# Altium schematic sheet stm32.SchDoc
size A4; SheetNumber: 7; SheetTotal: 8
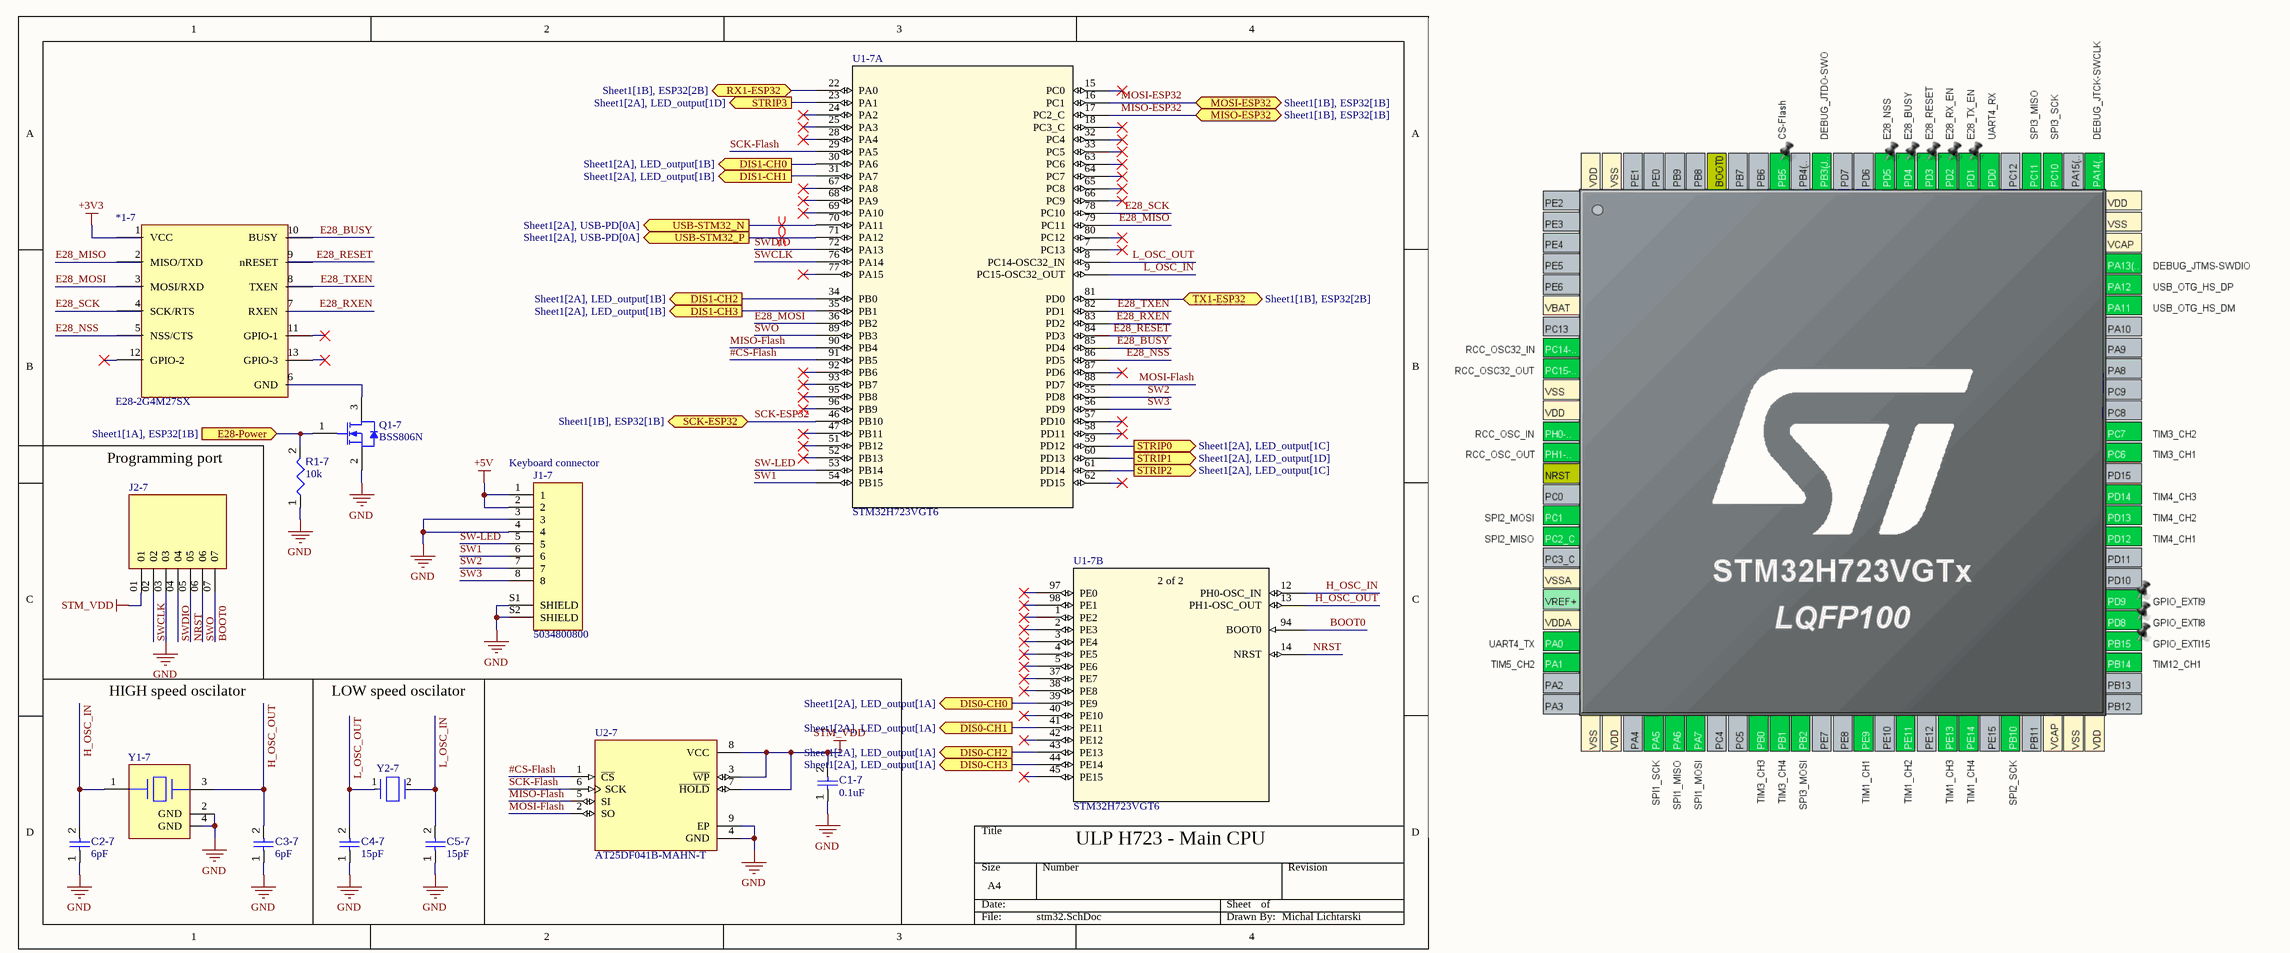
[diagram p0: stm32.SchDoc]

## Parts
*1-7  E28-2G4M27SX  [PCBComponent_1]
C1-7  value 0.1uF  [CAPC1608X94X35NL15T15]  (hidden comment: 0.1uF 0603)
C2-7  value 6pF  [CAPC1608X94X35NL15T15]  (hidden comment: 6pF 0603)
C3-7  value 6pF  [CAPC1608X94X35NL15T15]  (hidden comment: 6pF 0603)
C4-7  value 15pF  [CAPC1608X94X35NL15T15]  (hidden comment: 15pF 0603)
C5-7  value 15pF  [CAPC1608X94X35NL15T15]  (hidden comment: 15pF 0603)
J1-7  5034800800  [MOLEX_5034800800]
J2-7  TSW-107-07-G-S  [SAMTEC_TSW-107-07-G-S]  (value not drawn)
Q1-7  BSS806N  [INF-PG-SOT23_M]
R1-7  10K  [RESC1608X55X25ML10T15]
U1-7  STM32H723VGT6  [Model Name]  (parts A,B of 3)
U2-7  AT25DF041B-MAHN-T  [PSON50P200X300X60-9N]
Y1-7  CX2016DB40000D0FLJCC  [FP-CX2016DB-MFG]  (value not drawn)
Y2-7  ABS07-32.768KHZ-7-T  [FP-ABS07-MFG]  (value not drawn)

## Ports
DIS0-CH0 (out, see Sheet1[2A], LED_output[1A]), DIS0-CH1 (out, see Sheet1[2A], LED_output[1A]), DIS0-CH2 (out, see Sheet1[2A], LED_output[1A]), DIS0-CH3 (out, see Sheet1[2A], LED_output[1A]), DIS1-CH0 (out, see Sheet1[2A], LED_output[1B]), DIS1-CH1 (out, see Sheet1[2A], LED_output[1B]), DIS1-CH2 (out, see Sheet1[2A], LED_output[1B]), DIS1-CH3 (out, see Sheet1[2A], LED_output[1B]), E28-Power (in, see Sheet1[1A], ESP32[1B]), MISO-ESP32 (bidir, see Sheet1[1B], ESP32[1B]), MOSI-ESP32 (bidir, see Sheet1[1B], ESP32[1B]), RX1-ESP32 (bidir, see Sheet1[1B], ESP32[2B]), SCK-ESP32 (bidir, see Sheet1[1B], ESP32[1B]), STRIP0 (out, see Sheet1[2A], LED_output[1C]), STRIP1 (out, see Sheet1[2A], LED_output[1D]), STRIP2 (out, see Sheet1[2A], LED_output[1C]), STRIP3 (out, see Sheet1[2A], LED_output[1D]), TX1-ESP32 (bidir, see Sheet1[1B], ESP32[2B]), USB-STM32_N (out, see Sheet1[2A], USB-PD[0A]), USB-STM32_P (out, see Sheet1[2A], USB-PD[0A])

## Nets
+3V3: *1-7.1(VCC)
+5V: J1-7.1 J1-7.2
GND: C1-7.1 C2-7.1 C3-7.1 C4-7.1 C5-7.1 J1-7.3 J1-7.4 J1-7.S1(SHIELD) J1-7.S2(SHIELD) J2-7.03 Q1-7.2(SOURCE) R1-7.1 U2-7.4(GND) U2-7.9(EP) Y1-7.2(GND) Y1-7.4(GND)
STM_VDD: C1-7.2 J2-7.01 U2-7.3(~{WP}) U2-7.7(~{HOLD}) U2-7.8(VCC)
#CS-Flash: U1-7.91(PB5) U2-7.1(~{CS})
BOOT0: J2-7.07 U1-7.94(BOOT0)
DIS0-CH0: U1-7.39(PE9) ; port DIS0-CH0
DIS0-CH1: U1-7.41(PE11) ; port DIS0-CH1
DIS0-CH2: U1-7.43(PE13) ; port DIS0-CH2
DIS0-CH3: U1-7.44(PE14) ; port DIS0-CH3
DIS1-CH0: U1-7.30(PA6) ; port DIS1-CH0
DIS1-CH1: U1-7.31(PA7) ; port DIS1-CH1
DIS1-CH2: U1-7.34(PB0) ; port DIS1-CH2
DIS1-CH3: U1-7.35(PB1) ; port DIS1-CH3
E28-Power: Q1-7.1(GATE) R1-7.2 ; port E28-Power
E28_BUSY: *1-7.10(BUSY) U1-7.85(PD4)
E28_MISO: *1-7.2(MISO/TXD) U1-7.79(PC11)
E28_MOSI: *1-7.3(MOSI/RXD) U1-7.36(PB2)
E28_NSS: *1-7.5(NSS/CTS) U1-7.86(PD5)
E28_RESET: *1-7.9(nRESET) U1-7.84(PD3)
E28_RXEN: *1-7.7(RXEN) U1-7.83(PD2)
E28_SCK: *1-7.4(SCK/RTS) U1-7.78(PC10)
E28_TXEN: *1-7.8(TXEN) U1-7.82(PD1)
H_OSC_IN: C2-7.2 U1-7.12(PH0-OSC_IN) Y1-7.1
H_OSC_OUT: C3-7.2 U1-7.13(PH1-OSC_OUT) Y1-7.3
L_OSC_IN: C5-7.2 U1-7.9(PC15-OSC32_OUT) Y2-7.2
L_OSC_OUT: C4-7.2 U1-7.8(PC14-OSC32_IN) Y2-7.1
MISO-ESP32: U1-7.17(PC2_C) ; port MISO-ESP32
MISO-Flash: U1-7.90(PB4) U2-7.5(SI)
MOSI-ESP32: U1-7.16(PC1) ; port MOSI-ESP32
MOSI-Flash: U1-7.88(PD7) U2-7.2(SO)
NRST: J2-7.05 U1-7.14(NRST)
RX1-ESP32: U1-7.22(PA0) ; port RX1-ESP32
SCK-ESP32: U1-7.46(PB10) ; port SCK-ESP32
SCK-Flash: U1-7.29(PA5) U2-7.6(SCK)
STRIP0: U1-7.59(PD12) ; port STRIP0
STRIP1: U1-7.60(PD13) ; port STRIP1
STRIP2: U1-7.61(PD14) ; port STRIP2
STRIP3: U1-7.23(PA1) ; port STRIP3
SW1: J1-7.6 U1-7.54(PB15)
SW2: J1-7.7 U1-7.55(PD8)
SW3: J1-7.8 U1-7.56(PD9)
SW-LED: J1-7.5 U1-7.53(PB14)
SWCLK: J2-7.02 U1-7.76(PA14)
SWDIO: J2-7.04 U1-7.72(PA13)
SWO: J2-7.06 U1-7.89(PB3)
TX1-ESP32: U1-7.81(PD0) ; port TX1-ESP32
USB-STM32_N: U1-7.70(PA11) ; port USB-STM32_N
USB-STM32_P: U1-7.71(PA12) ; port USB-STM32_P
Net*1-7_6: *1-7.6(GND) Q1-7.3(DRAIN)

Not connected (* = marked no-connect by the designer): *1-7 11(GPIO-1) 12(GPIO-2) 13(GPIO-3); U1-7 1(PE2)* 2(PE3)* 3(PE4)* 4(PE5)* 5(PE6)* 7(PC13)* 15(PC0)* 18(PC3_C)* 24(PA2)* 25(PA3)* 28(PA4)* 32(PC4)* 33(PC5)* 37(PE7)* 38(PE8)* 40(PE10)* 42(PE12)* 45(PE15)* 47(PB11)* 51(PB12)* 52(PB13)* 57(PD10)* 58(PD11)* 62(PD15)* 63(PC6)* 64(PC7)* 65(PC8)* 66(PC9)* 67(PA8)* 68(PA9)* 69(PA10)* 77(PA15)* 80(PC12)* 87(PD6)* 92(PB6)* 93(PB7)* 95(PB8)* 96(PB9)* 97(PE0)* 98(PE1)*

## Layout directives
differential pair: USB-STM32_N, USB-STM32_P

## Notes on the sheet
- Programming port
- (near J1-7) Keyboard connector
- HIGH speed oscilator
- LOW speed oscilator
- ULP H723 - Main CPU
- Michal Lichtarski
- (in symbol STM32H723VGT6, part B) 2 of 2

## Library data of the parts
*1-7 = CMP-021-00007-7: Frequency: 2.4GHz; Min Supply Voltage: 2.5V; Max Supply Voltage: 3.6V
C1-7 C2-7 C3-7 C4-7 C5-7 = CMP-001-00003-6: Chip Capacitor, 1 uF, +/- 10%, 16 V, 0603 (1608 Metric); Voltage Rating: 16V; Capacitor Type: Ceramic; Max Operating Temperature: 125°C; Pins: 2; Tolerance: 10%; Min Operating Temperature: -55°C; RoHS Compliant: True; Mounting Technology: SM; Case/Package: 0603
J1-7 = 5034800800: 8 Position FFC, FPC Connector Contacts, Top and Bottom 0.020" (0.50mm) Surface Mount, Right Angle; MF: {'manufacturer': u'Molex'}; Package: None; Price: None; Value: *; MP: 5034800800; Availability: Unavailable
J2-7 = TSW-107-07-G-S: MF: {'manufacturer': u'Samtec Inc.'}; Package: None; Price: None; Value: *; MP: TSW-107-07-G-S; Availability: Unavailable
Q1-7 = CMP-1149-00036-1: N-Channel OptiMOS 2 Small-Signal-Transistor, 20 V VDS, 2.3 A ID, -55 to 150 degC, PG-SOT23, Reel, Green; Manufacturer: Infineon; VDS (max): 20 V; RthJA (max): 250 K/W; VGS(th) (max): 0.75Â V; QG: 1.7Â nC; RDS (on) (max) (@2.5V): 57 mOhm; VGS(th) (min): 0.3Â V; Ptot (max): 0.5Â W; Green: TRUE; IDpuls (max): 9.3Â A; ID (max): 2.3Â A; RDS (on) (max) (@1.8V): 82 mOhm; Halogen-free: TRUE; PackageVersion: Apr-08; PackageReference: PG-SOT23; PackageDescription: 3-Pin Small Outline Transistor Package, 2.9 x 1.3 mm Body, 0.95 mm Pitch; ComponentLink3URL: http://www.infineon.com/dgdl/SOT23-Package_Overview.pdf?folderId=db3a30431936bc4b0119532290053c66&fileId=db3a30431936bc4b0119533468123c85; ComponentLink3Description: Package Specification; ComponentLink2Description: Datasheet; Packing: Reel; Mounting Technology: Surface Mount; PartNumber: BSS806N; RDS (on) (max): 57 mOhm; ComponentLink2URL: http://www.infineon.com/dgdl/BSS806N_Rev2.3_.pdf?folderId=db3a3043156fd573011622e10b5c1f67&fileId=db3a304330f686060131185f0553451c; ComponentLink1URL: http://www.infineon.com/; ComponentLink1Description: Manufacturer URL; DatasheetVersion: Rev. 2.3
R1-7 = CMP-009-00031-5: Tolerance: 1%; Power: 100mW; Mounting Technology: SM; Case/Package: 0603; Value: 10k; RoHS Compliant: True; Pins: 2; Min Operating Temperature: -55°C; Max Operating Temperature: 155°C
U1-7 = STM32H723VGT6: No Description Available; Mfr_Name: STMicroelectronics; RefDes: RefDes; Type: Type
U2-7 = AT25DF041B-MAHN-T: MF: {'manufacturer': u'Dialog Semiconductor'}; Package: None; Price: None; Value: *; MP: AT25DF041B-MAHN-T; Availability: Unavailable
Y1-7 = CMP-20727-000002-1: CRYSTAL 40.0000MHZ 8PF SMD; Manufacturer: Kyocera International Inc. Electronic Components; Esr: 50Ω; Tolerance: 15ppm; Frequency: 40MHz; Series: CX2016DB; RoHS: TRUE; Temperature Range High: +85°C; Height: 0.45mm; Manufacturer Part Number: CX2016DB40000D0FLJCC; ComponentLink2Description: Datasheet; Load Capacitance: 8pF; ComponentLink2URL: https://global.kyocera.com/prdct/electro/product/pdf/cx2016db_e.pdf; Temperature: -30°C to +85°C; Device Class L2: Crystals / Oscillators; Category: Crys; Mouser Description: Crystal 40MHz 8pF 4-Pin SMD T/R; Lead Free: Yes; Device Class L3: Crystals; Temperature Range Low: -30°C; Octopart: https://octopart.com/cx2016db40000d0fljcc-avx+%2F+kyocera-71139660; Device Class L1: Passive Components; Automotive: No; Digikey Description: CRYSTAL 40.0000MHZ 8PF SMD; Package: CX2016DB; Stability: 15ppm
Y2-7 = CMP-27762-014373-1: Crystal 32.768kHz ±20ppm (Tol) 7pF FUND 70kΩ 2-Pin CSMD T/R; Insulation Resistance: 500MR; Series Resistance: 70kR; Mount: Surface Mount; Tolerance: 20ppm; Length: 3.2mm; Lead Free: Lead Free; Frequency: 32.768kHz; Frequency Tolerance: 20ppm; Frequency Stability: 20ppm; Load Capacitance: 7pF; Radiation Hardening: No; Package Quantity: 3000; Width: 1.5mm; Height: 0.9mm; Termination: SMD/SMT; Max Operating Temperature: 85°C; Number of Pins: 2; Operating Frequency: 32.768 kHz; ESR (Equivalent Series Resistance): 70kR; Packaging: Tape and Reel; Series: ABS07; Min Operating Temperature: -40°C; Depth: 1.5mm; Case/Package: CSMD